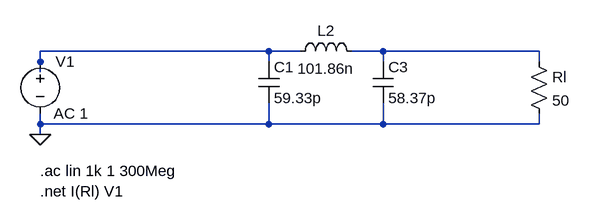
[diagram p0: schematic ideal.asc]
ideal.asc, the LTspice schematic file:
Version 4
SHEET 1 1828 680
WIRE 768 128 416 128
WIRE 816 128 768 128
WIRE 944 128 896 128
WIRE 1184 128 944 128
WIRE 416 144 416 128
WIRE 768 144 768 128
WIRE 944 144 944 128
WIRE 1184 144 1184 128
WIRE 416 160 416 144
WIRE 416 240 416 224
WIRE 768 240 768 208
WIRE 768 240 416 240
WIRE 944 240 944 208
WIRE 944 240 768 240
WIRE 1184 240 1184 224
WIRE 1184 240 944 240
WIRE 416 256 416 240
FLAG 416 256 0
SYMBOL Voltage 416 128 R0
WINDOW 3 24 96 Invisible 2
WINDOW 123 21 96 Left 2
SYMATTR Value ""
SYMATTR Value2 AC 1
SYMATTR InstName V1
SYMATTR SpiceLine Rser=50
SYMBOL Cap 752 144 R0
SYMATTR InstName C1
SYMATTR Value 59.33p
SYMBOL Cap 928 144 R0
SYMATTR InstName C3
SYMATTR Value 58.37p
SYMBOL Ind 800 144 R270
WINDOW 0 32 56 VTop 2
WINDOW 3 5 56 VBottom 2
SYMATTR InstName L2
SYMATTR Value 101.86n
SYMBOL Res 1168 128 R0
SYMATTR InstName Rl
SYMATTR Value 50
TEXT 416 312 Left 2 !.ac lin 1k 1 300Meg
TEXT 416 344 Left 2 !.net I(Rl) V1

The netlist it stands for:
* ideal.asc
V1 N001 0 AC 1 Rser=50
C1 N001 0 59.33p
C3 N002 0 58.37p
L2 N001 N002 101.86n
Rl N002 0 50
.ac lin 1k 1 300Meg
.net I(Rl) V1
.backanno
.end